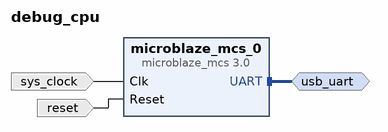
[diagram p0: block diagram of the top level]
# Vivado block design debug_cpu, xc7a100tcsg324-1, Vivado 2019.2.1
create_bd_design debug_cpu

create_bd_intf_port -mode Master -vlnv xilinx.com:interface:uart_rtl:1.0 usb_uart
create_bd_port -dir I -type clk sys_clock
set_property -dict {CONFIG.FREQ_HZ 100000000 CONFIG.PHASE 0.000} [get_bd_ports sys_clock]
create_bd_port -dir I -type rst reset
set_property -dict {CONFIG.POLARITY ACTIVE_LOW} [get_bd_ports reset]

create_bd_cell -type ip -vlnv xilinx.com:ip:microblaze_mcs:3.0 microblaze_mcs_0
set_property -dict [list \
  CONFIG.CLK_BOARD_INTERFACE sys_clock \
  CONFIG.DEBUG_ENABLED 2 \
  CONFIG.MEMSIZE 65536 \
  CONFIG.RESET_BOARD_INTERFACE reset \
  CONFIG.UART_BOARD_INTERFACE usb_uart \
  CONFIG.USE_BOARD_FLOW true \
] [get_bd_cells microblaze_mcs_0]

# ---- connections ----

connect_bd_intf_net [get_bd_intf_ports usb_uart] [get_bd_intf_pins microblaze_mcs_0/UART]
connect_bd_net [get_bd_ports sys_clock] [get_bd_pins microblaze_mcs_0/Clk]
connect_bd_net [get_bd_ports reset] [get_bd_pins microblaze_mcs_0/Reset]

validate_bd_design
save_bd_design
